# Altium schematic sheet UsbKiller.SchDoc
size A4
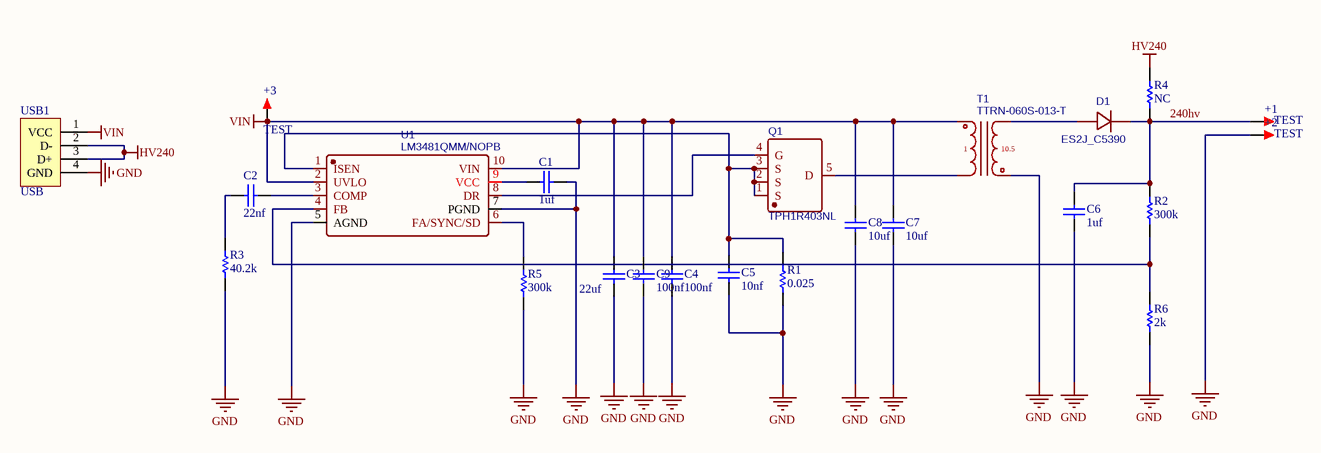
[diagram p0: UsbKiller.SchDoc]

## Parts
+1  TEST  [Test Point SMD 1.0]
+2  TEST  [Test Point SMD 1.0]
+3  TEST  [Test Point SMD 1.0]
C1  1uf  [C 0603]
C2  22nf  [C 0603]
C3  22uf  [C 0603]
C4  100nf  [C 0603]
C5  10nf  [C 0603]
C6  1uf  [1812]
C7  10uf  [C 0805]
C8  10uf  [C 0805]
C9  100nf  [C 0603]
D1  ES2J_C5390  [SMA]
Q1  TPH1R403NL  [PDFN8]
R1  0.025  [RES 1206]
R2  300k  [R 0603]
R3  40.2k  [R 0603]
R4  NC  [R 0603]
R5  300k  [R 0603]
R6  2k  [R 0603]
T1  TTRN-060S-013-T  [TTRN-013 Dorp]
U1  LM3481QMM/NOPB  [VSSOP-10]
USB1  USB  [USB_A/P_A]

## Nets
GND: +2.1 C1.1 C3.2 C4.2 C5.2 C6.2 C7.2 C8.2 C9.2 R1.1 R3.1 R5.1 R6.1 T1.3 U1.5(AGND) U1.7(PGND) USB1.4(GND)
HV240: R4.2 USB1.2(D-) USB1.3(D+)
VIN: +3.1 C3.1 C4.1 C7.1 C8.1 C9.1 T1.1 U1.2(UVLO) U1.10(VIN) USB1.1(VCC)
240hv: +1.1 C6.1 D1.2(C) R2.2 R4.1
NetC1_2: C1.2 U1.9(VCC)
NetC2_1: C2.1 R3.2
NetC2_2: C2.2 U1.3(COMP)
NetC5_1: C5.1 Q1.1(S) Q1.2(S) Q1.3(S) R1.2 U1.1(ISEN)
NetD1_1: D1.1(A) T1.2
NetQ1_4: Q1.4(G) U1.8(DR)
NetQ1_5: Q1.5(D) T1.5
NetR2_1: R2.1 R6.2 U1.4(FB)
NetR5_2: R5.2 U1.6(FA/SYNC/SD)

## Notes on the sheet
- (in symbol TTRN-060S-013-T) 10.5

## Library data of the parts
+1-+3 = TEST: 测试点; 版权归属: 源创客; BOM名称: 测试点; 学习资源: www.ooocke.com
C1-C9 = Cap: 贴片电容; Published: 8-Jun-2000; LatestRevisionDate: 17-Jul-2002; LatestRevisionNote: Re-released for DXP Platform.; PackageReference: RAD-0.3; Publisher: Altium Limited; PackageDescription: Radial Cap, Thru-Hole; 2 Leads; 0.3 in Pin Spacing
D1 = ES2J_C5390: BOM_Manufacturer Part: ES2J; BOM_Manufacturer: MDD; SMT Type: Extend; BOM_Supplier: LCSC; image: //image.lceda.cn/szlcsc/C5390.jpg; BOM_Supplier Part: C5390; BOM_LCSC Assembly: Yes; spicePre: D; spiceSymbolName: ES2J_C5390
Q1 = TPH1R403NL: BOM_Manufacturer: TOSHIBA; SMT Type: Extend; BOM_Supplier: LCSC; BOM_Manufacturer Part: TPH1R403NL; BOM_Supplier Part: C83440; BOM_LCSC Assembly: Yes; spicePre: Q; spiceSymbolName: TPH1R403NL
R1-R6 = Res1: 贴片电阻; Published: 8-Jun-2000; LatestRevisionDate: 17-Jul-2002; LatestRevisionNote: Re-released for DXP Platform.; PackageReference: AXIAL-0.3; Publisher: Altium Limited; PackageDescription: Axial Device, Thru-Hole; 2 Leads; 0.3 in Pin Spacing
T1 = TTRN-060S-013-T: Contributor: ChaoJiSuanMiao; spicePre: T; spiceSymbolName: TTRN-060S-013-T
U1 = LM3481QMM/NOPB: BOM_Manufacturer: Texas Instruments; Contributor: LCSC; BOM_Supplier: LCSC; BOM_Supplier Part: C205461; BOM_Manufacturer Part: LM3481QMM/NOPB; spicePre: U; spiceSymbolName: LM3481QMM/NOPB
USB1 = USB-A/P: USB-A型公接口; 版权归属: 源创客; BOM名称: USB-A型公接口; 学习资源: www.ooocke.com